# EAGLE design usbUnifier (EAGLE 8.3.2)
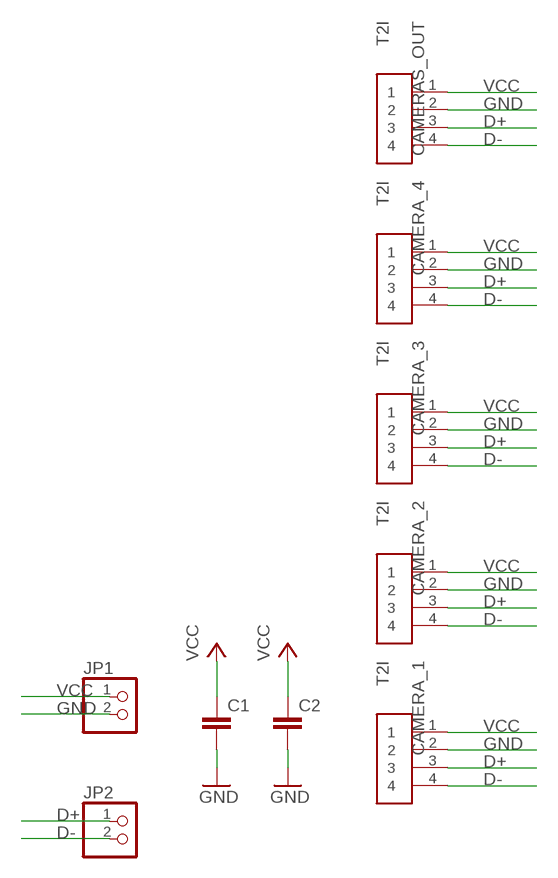
[diagram p0: schematic, sheet 1]

## Parts
C1  C-EUC0603  [C0603]
C2  C-EUC0603  [C0603]
CAMERA_1  T2I  [T2I]
CAMERA_2  T2I  [T2I]
CAMERA_3  T2I  [T2I]
CAMERA_4  T2I  [T2I]
CAMERAS_OUT  T2I  [T2I]
JP1  PINHD-1X2  [1X02]
JP2  PINHD-1X2  [1X02]

## Nets
D+: CAMERA_1.3 CAMERA_2.3 CAMERA_3.3 CAMERA_4.3 CAMERAS_OUT.3 JP2.1
D-: CAMERA_1.4 CAMERA_2.4 CAMERA_3.4 CAMERA_4.4 CAMERAS_OUT.4 JP2.2
GND: C1.2 C2.2 CAMERA_1.2 CAMERA_2.2 CAMERA_3.2 CAMERA_4.2 CAMERAS_OUT.2 JP1.2
VCC: C1.1 C2.1 CAMERA_1.1 CAMERA_2.1 CAMERA_3.1 CAMERA_4.1 CAMERAS_OUT.1 JP1.1

## Library data of the parts
C1 C2 = rcl:C-EU: CAPACITOR, European symbol
CAMERA_1-CAMERA_4 CAMERAS_OUT = BackplaneParts:T2I
JP1 JP2 = pinhead:PINHD-1X2: PIN HEADER

## Board
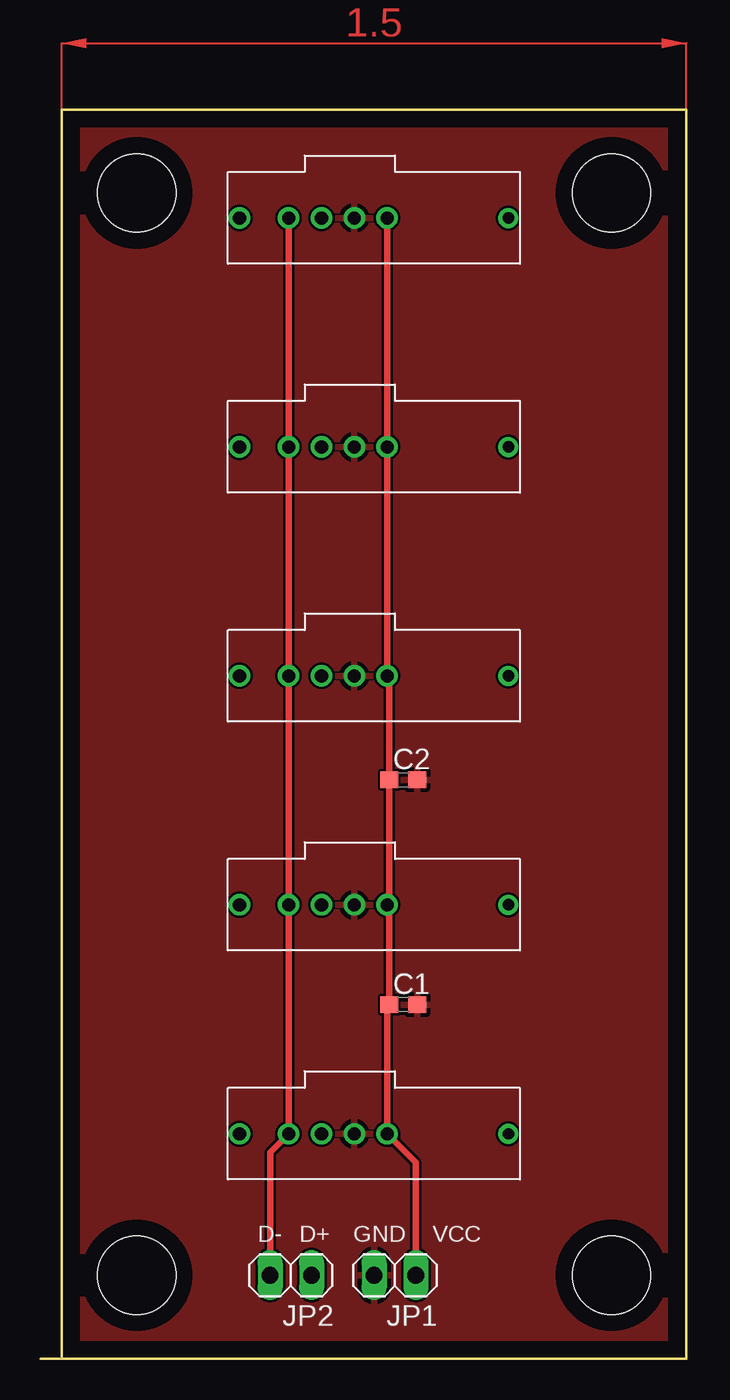
[diagram p1: board, top side]
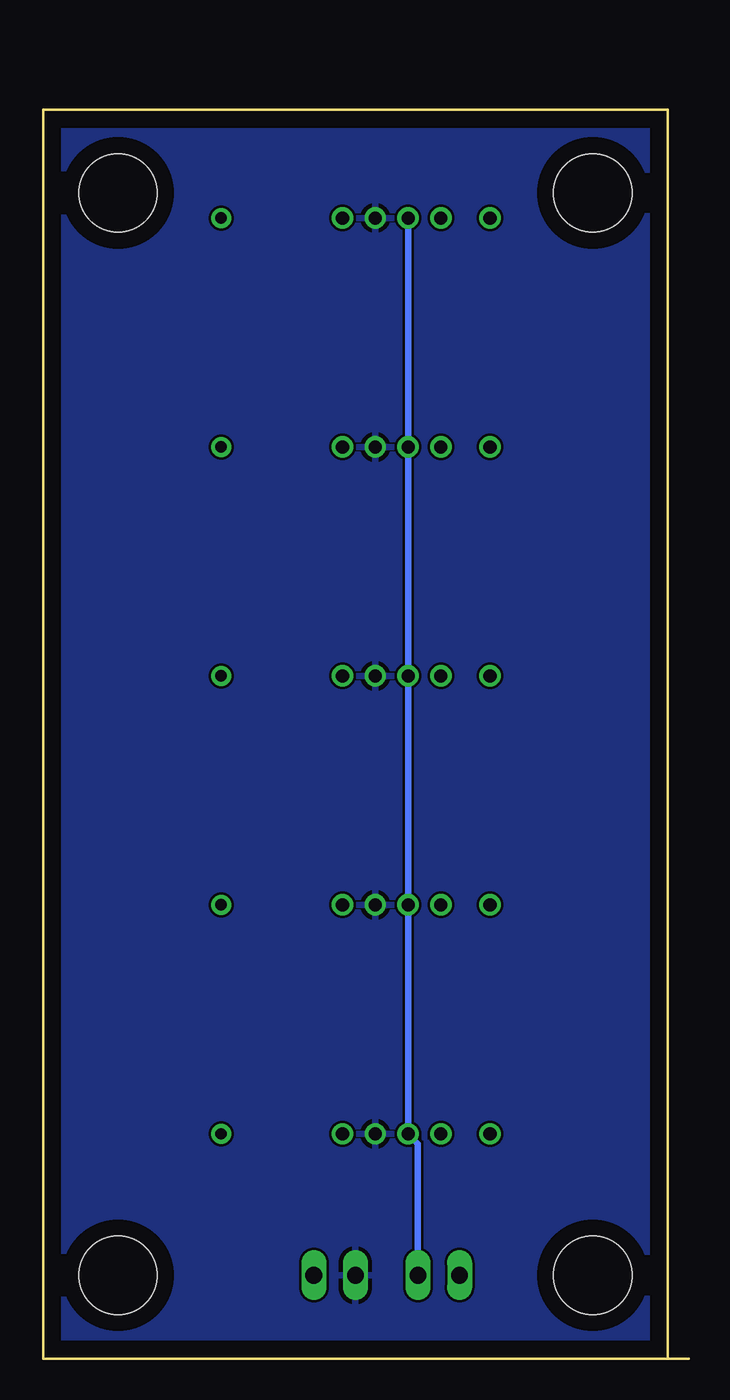
[diagram p2: board, bottom side, seen from below]

Size 39.37 x 76.2 mm. Coordinates in mm from the lower left corner, seen from the top.
Outline: 0,0 1.27,0
Outline: 1.27,0 39.37,0 39.37,76.2 1.27,76.2 1.27,0
Copper layers (1*16): Top 0.035mm / dielectric 1.5mm / Bottom 0.035mm
Design rules "default": minimum track width 6mil, minimum drill 0.35mm, track to track 6mil, track to pad 6mil, pad to pad 6mil, via to via 6mil, smd to smd 6mil, copper to edge 40mil, drill to drill 6mil, minimum pad ring 10mil, minimum via ring 8mil, stop-mask expansion 4mil, vias tented up to drill 0mil, thermal gap 10mil
Holes 4.76 mm at 5.84,71.12 34.8,71.12 5.84,5.08 34.8,5.08

### Footprints (pad centres in the part's own frame; a part is rotated, then mirrored left to right if it is on the bottom)
C0603 = smd 1.1 x 1: 1 -0.85,0; 2 0.85,0
T2I = drill 0.8: 1 8.1,2.8; 2 10.1,2.8; 3 12.1,2.8; 4 14.1,2.8; S2 17.1,2.8 | drill 0.7: S1 0.7,2.8
1X02 = drill 1.016 long: 1 -1.27,0; 2 1.27,0

### Placement (x,y rotation side)
C1  22.1,21.59 0 top
C2  22.1,35.31 0 top
CAMERA_1  29.21,16.51 180 top
CAMERA_2  29.21,30.48 180 top
CAMERA_3  29.21,44.45 180 top
CAMERA_4  29.21,58.42 180 top
CAMERAS_OUT  29.21,72.39 180 top
JP1  21.59,5.08 180 top
JP2  15.24,5.08 180 top

### Tracks (layer width: path | path; a pad name or v marks a point on that pad's centre or on a via)
D+
  Bottom 0.406: JP2.1 16.51,13.11 CAMERA_1.3 CAMERA_2.3 CAMERA_3.3 CAMERA_4.3 CAMERAS_OUT.3
D-
  Top 0.406: JP2.2 13.97,12.57 CAMERA_1.4 CAMERA_2.4 CAMERA_3.4 CAMERA_4.4 CAMERAS_OUT.4
GND
  pour Bottom: 1.27,0 1.27,76.2 39.37,76.2 39.37,0
  pour Top: 1.27,0 1.27,76.2 39.37,76.2 39.37,0
VCC
  Top 0.406: JP1.1 22.86,11.96 CAMERA_1.1 21.11,21.45 C1.1 21.25,27.54 CAMERA_2.1 21.25,27.82 C2.1 21.25,41.51 CAMERA_3.1 CAMERA_4.1 CAMERAS_OUT.1
(copper drawn outside any net)
  shapes: Top area x1

### Text on the board
tPlace: D- | D+ | GND | VCC